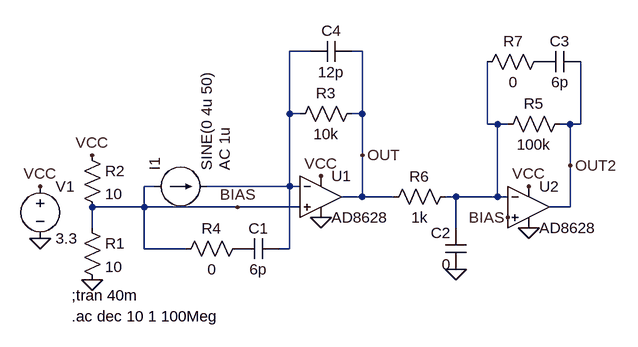
[diagram p0: schematic Current-Transformer3.asc]
Current-Transformer3.asc, the LTspice schematic file:
Version 4
SHEET 1 880 680
WIRE 352 -64 320 -64
WIRE 432 -64 416 -64
WIRE 320 32 320 -64
WIRE 336 32 320 32
WIRE 432 32 432 -64
WIRE 432 32 416 32
WIRE 624 48 624 -48
WIRE 640 48 624 48
WIRE 656 48 640 48
WIRE 752 48 736 48
WIRE 768 48 768 -48
WIRE 768 48 752 48
WIRE 432 96 432 32
WIRE 752 112 752 48
WIRE 112 144 96 144
WIRE 320 144 320 32
WIRE 320 144 192 144
WIRE 336 144 320 144
WIRE 432 160 432 96
WIRE 432 160 400 160
WIRE 480 160 432 160
WIRE 576 160 560 160
WIRE 640 160 640 48
WIRE 640 160 576 160
WIRE 656 160 640 160
WIRE 96 176 96 144
WIRE 96 176 16 176
WIRE 240 176 96 176
WIRE 336 176 240 176
WIRE 752 176 752 112
WIRE 752 176 720 176
WIRE 16 208 16 176
WIRE 576 208 576 160
WIRE 96 240 96 176
WIRE 160 240 96 240
WIRE 320 240 320 144
WIRE 320 240 304 240
FLAG -64 144 VCC
FLAG -64 224 0
FLAG 368 192 0
FLAG 368 128 VCC
FLAG 16 288 0
FLAG 16 96 VCC
FLAG 432 96 OUT
FLAG 688 208 0
FLAG 688 144 VCC
FLAG 752 112 OUT2
FLAG 240 176 BIAS
FLAG 656 192 BIAS
FLAG 576 272 0
SYMBOL voltage -64 128 R0
WINDOW 123 0 0 Left 0
WINDOW 39 0 0 Left 0
SYMATTR InstName V1
SYMATTR Value 3.3
SYMBOL current 112 144 R270
WINDOW 123 24 108 Left 2
WINDOW 39 0 0 Left 0
SYMATTR Value2 AC 1u
SYMATTR InstName I1
SYMATTR Value SINE(0 4u 50)
SYMBOL Opamps\\AD8628 368 96 R0
SYMATTR InstName U1
SYMBOL res 0 192 R0
SYMATTR InstName R1
SYMATTR Value 10
SYMBOL res 0 80 R0
SYMATTR InstName R2
SYMATTR Value 10
SYMBOL res 432 16 R90
WINDOW 0 0 56 VBottom 2
WINDOW 3 32 56 VTop 2
SYMATTR InstName R3
SYMATTR Value 10k
SYMBOL res 256 224 R90
WINDOW 0 0 56 VBottom 2
WINDOW 3 32 56 VTop 2
SYMATTR InstName R4
SYMATTR Value 0
SYMBOL cap 304 224 R90
WINDOW 0 0 32 VBottom 2
WINDOW 3 32 32 VTop 2
SYMATTR InstName C1
SYMATTR Value 6p
SYMBOL Opamps\\AD8628 688 112 R0
SYMATTR InstName U2
SYMBOL res 752 32 R90
WINDOW 0 0 56 VBottom 2
WINDOW 3 32 56 VTop 2
SYMATTR InstName R5
SYMATTR Value 100k
SYMBOL res 576 144 R90
WINDOW 0 0 56 VBottom 2
WINDOW 3 32 56 VTop 2
SYMATTR InstName R6
SYMATTR Value 1k
SYMBOL cap 592 272 R180
WINDOW 0 24 56 Left 2
WINDOW 3 24 8 Left 2
SYMATTR InstName C2
SYMATTR Value 0
SYMBOL res 720 -64 R90
WINDOW 0 0 56 VBottom 2
WINDOW 3 32 56 VTop 2
SYMATTR InstName R7
SYMATTR Value 0
SYMBOL cap 704 -32 R270
WINDOW 0 32 32 VTop 2
WINDOW 3 0 32 VBottom 2
SYMATTR InstName C3
SYMATTR Value 6p
SYMBOL cap 416 -80 R90
WINDOW 0 0 32 VBottom 2
WINDOW 3 32 32 VTop 2
SYMATTR InstName C4
SYMATTR Value 12p
TEXT -16 312 Left 2 !;tran 40m
TEXT -16 344 Left 2 !.ac dec 10 1 100Meg

The netlist it stands for:
* Current-Transformer3.asc
V1 VCC 0 3.3
I1 BIAS N001 SINE(0 4u 50) AC 1u
XU1 BIAS N001 VCC 0 OUT AD8628  ; pins In+ In- V+ V- OUT
R1 BIAS 0 10
R2 VCC BIAS 10
R3 OUT N001 10k
R4 P001 BIAS 0
C1 N001 P001 6p
XU2 BIAS N002 VCC 0 OUT2 AD8628  ; pins In+ In- V+ V- OUT
R5 OUT2 N002 100k
R6 N002 OUT 1k
C2 0 N002 0
R7 P002 N002 0
C3 P002 OUT2 6p
C4 OUT N001 12p
;tran 40m
.ac dec 10 1 100Meg
.backanno
.end